# EAGLE schematic Solar_Panel_Board_v6.1 (EAGLE 9.6.2)
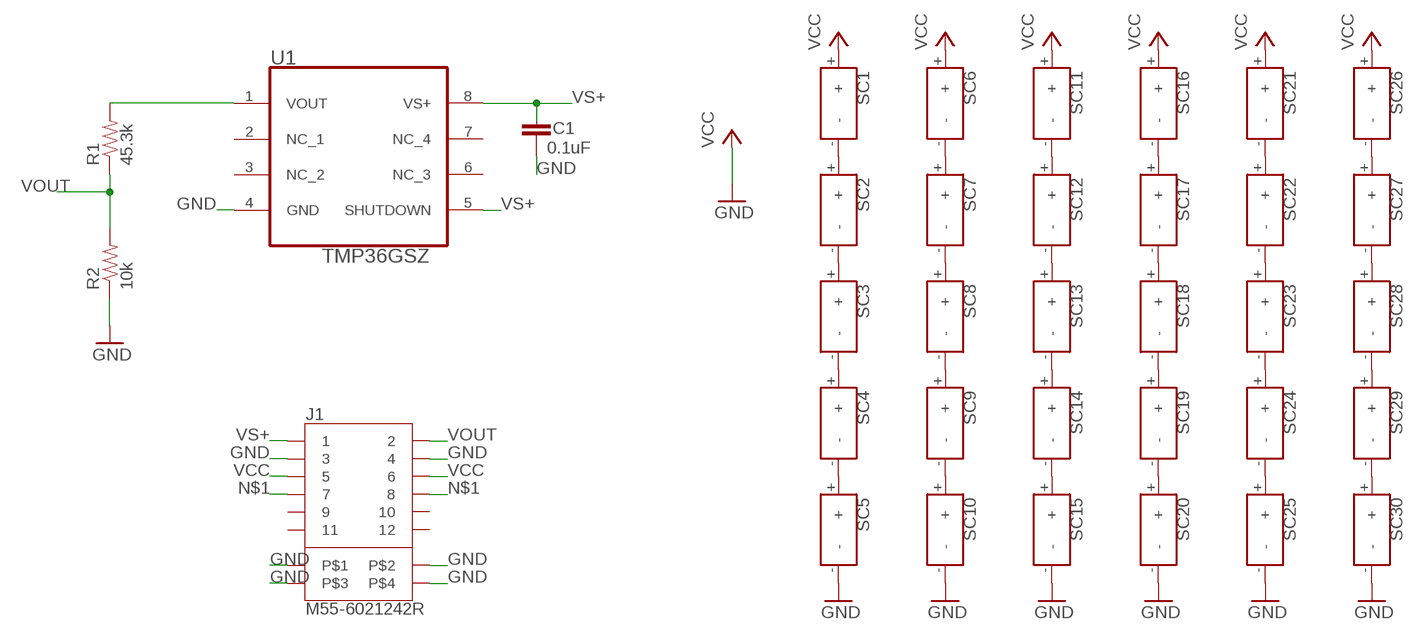
[diagram p0: schematic, sheet 1]

## Parts
C1  0.1uF  CAP0805  [0805]
J1  M55-6021242R  [M55-6021242R]
R1  45.3k  RESISTOR0805-RES  [0805]
R2  10k  RESISTOR0805-RES  [0805]
SC1  KXOB25-05X3F  [KXOB25-05X3F]
SC2  KXOB25-05X3F  [KXOB25-05X3F]
SC3  KXOB25-05X3F  [KXOB25-05X3F]
SC4  KXOB25-05X3F  [KXOB25-05X3F]
SC5  KXOB25-05X3F  [KXOB25-05X3F]
SC6  KXOB25-05X3F  [KXOB25-05X3F]
SC7  KXOB25-05X3F  [KXOB25-05X3F]
SC8  KXOB25-05X3F  [KXOB25-05X3F]
SC9  KXOB25-05X3F  [KXOB25-05X3F]
SC10  KXOB25-05X3F  [KXOB25-05X3F]
SC11  KXOB25-05X3F  [KXOB25-05X3F]
SC12  KXOB25-05X3F  [KXOB25-05X3F]
SC13  KXOB25-05X3F  [KXOB25-05X3F]
SC14  KXOB25-05X3F  [KXOB25-05X3F]
SC15  KXOB25-05X3F  [KXOB25-05X3F]
SC16  KXOB25-05X3F  [KXOB25-05X3F]
SC17  KXOB25-05X3F  [KXOB25-05X3F]
SC18  KXOB25-05X3F  [KXOB25-05X3F]
SC19  KXOB25-05X3F  [KXOB25-05X3F]
SC20  KXOB25-05X3F  [KXOB25-05X3F]
SC21  KXOB25-05X3F  [KXOB25-05X3F]
SC22  KXOB25-05X3F  [KXOB25-05X3F]
SC23  KXOB25-05X3F  [KXOB25-05X3F]
SC24  KXOB25-05X3F  [KXOB25-05X3F]
SC25  KXOB25-05X3F  [KXOB25-05X3F]
SC26  KXOB25-05X3F  [KXOB25-05X3F]
SC27  KXOB25-05X3F  [KXOB25-05X3F]
SC28  KXOB25-05X3F  [KXOB25-05X3F]
SC29  KXOB25-05X3F  [KXOB25-05X3F]
SC30  KXOB25-05X3F  [KXOB25-05X3F]
U1  TMP36GSZ  [SOIC127P600X175-8N]

## Nets
GND: C1.2 J1.3 J1.4 J1.P$1 J1.P$2 J1.P$3 J1.P$4 R2.1 SC5.- SC10.- SC15.- SC20.- SC25.- SC30.- U1.4(GND)
N$1: J1.7 J1.8
N$2: SC7.- SC8.+
N$3: SC4.- SC5.+
N$4: SC3.- SC4.+
N$5: SC2.- SC3.+
N$6: SC1.- SC2.+
N$7: SC8.- SC9.+
N$8: SC16.- SC17.+
N$9: SC14.- SC15.+
N$10: SC13.- SC14.+
N$11: SC9.- SC10.+
N$12: R1.2 U1.1(VOUT)
N$13: SC11.- SC12.+
N$14: SC23.- SC24.+
N$15: SC22.- SC23.+
N$16: SC21.- SC22.+
N$17: SC6.- SC7.+
N$18: SC17.- SC18.+
N$19: SC19.- SC20.+
N$20: SC12.- SC13.+
N$21: SC28.- SC29.+
N$22: SC29.- SC30.+
N$23: SC26.- SC27.+
N$24: SC24.- SC25.+
N$25: SC18.- SC19.+
N$26: SC27.- SC28.+
VCC: J1.5 J1.6 SC1.+ SC6.+ SC11.+ SC16.+ SC21.+ SC26.+ ; supply symbol labelled GND
VOUT: J1.2 R1.1 R2.2
VS+: C1.1 J1.1 U1.5(SHUTDOWN) U1.8(VS+)
Unconnected: J1.9 J1.10 J1.11 J1.12 U1.2(NC_1) U1.3(NC_2) U1.6(NC_3) U1.7(NC_4)

## Library data of the parts
C1 = HSFL_Main_Library:CAP: Capacitor Standard 0603 ceramic capacitor, and 0.1" leaded capacitor.
J1 = M55-6021242R:M55-6021242R
R1 R2 = HSFL_Main_Library:RESISTOR: Resistor Basic schematic elements and footprints for 0603, 1206, and PTH resistors.
SC1-SC30 = untitled:KXOB25-05X3F: KXOB25-05X3F - Monocrystalline Solar Cell 30.7mW, 2.07V
U1 = TMP36GSZ:TMP36GSZ